# Altium schematic sheet LED_USB_KEY.SchDoc
size 558 x 431 mm
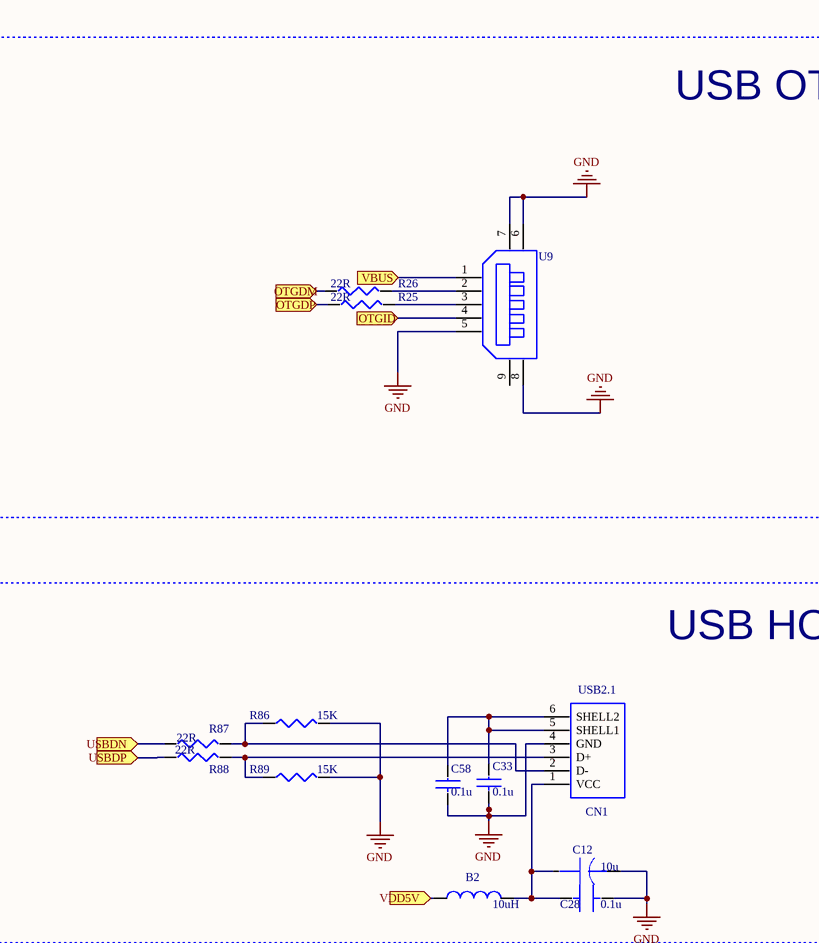
[diagram p0: LED_USB_KEY.SchDoc, top left]
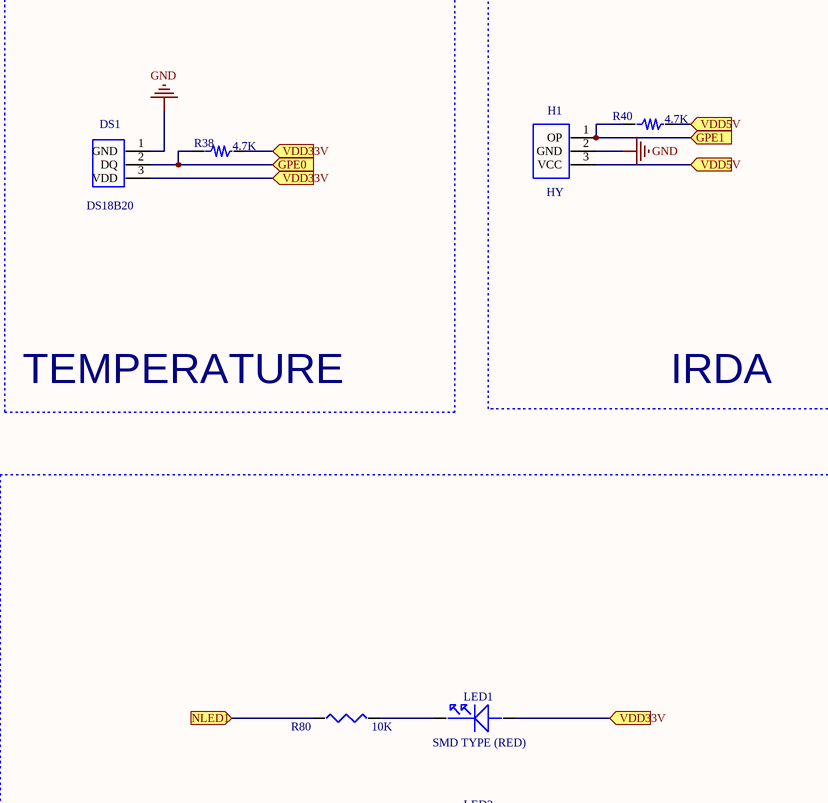
[diagram p1: LED_USB_KEY.SchDoc, top right]
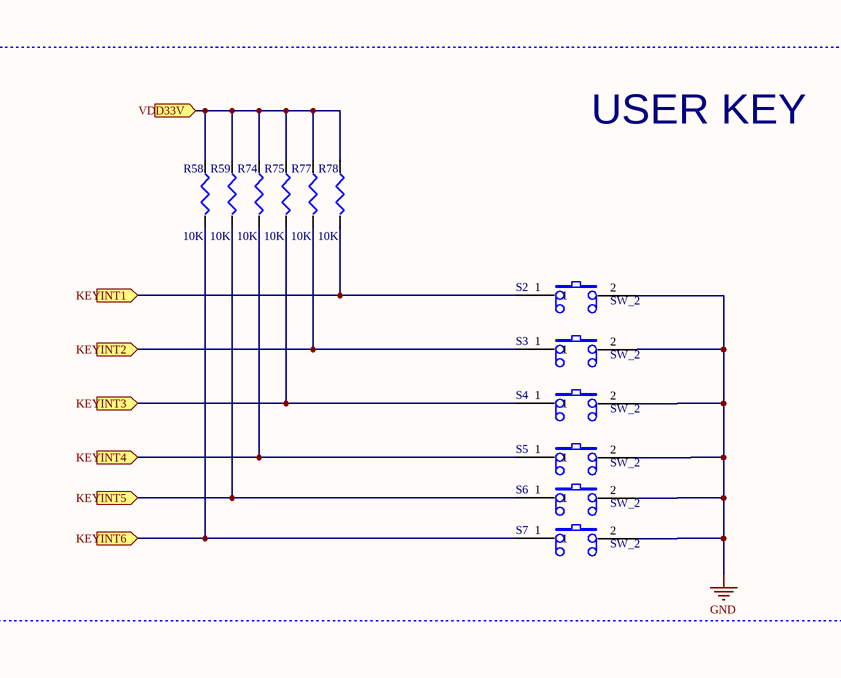
[diagram p2: LED_USB_KEY.SchDoc, bottom left]
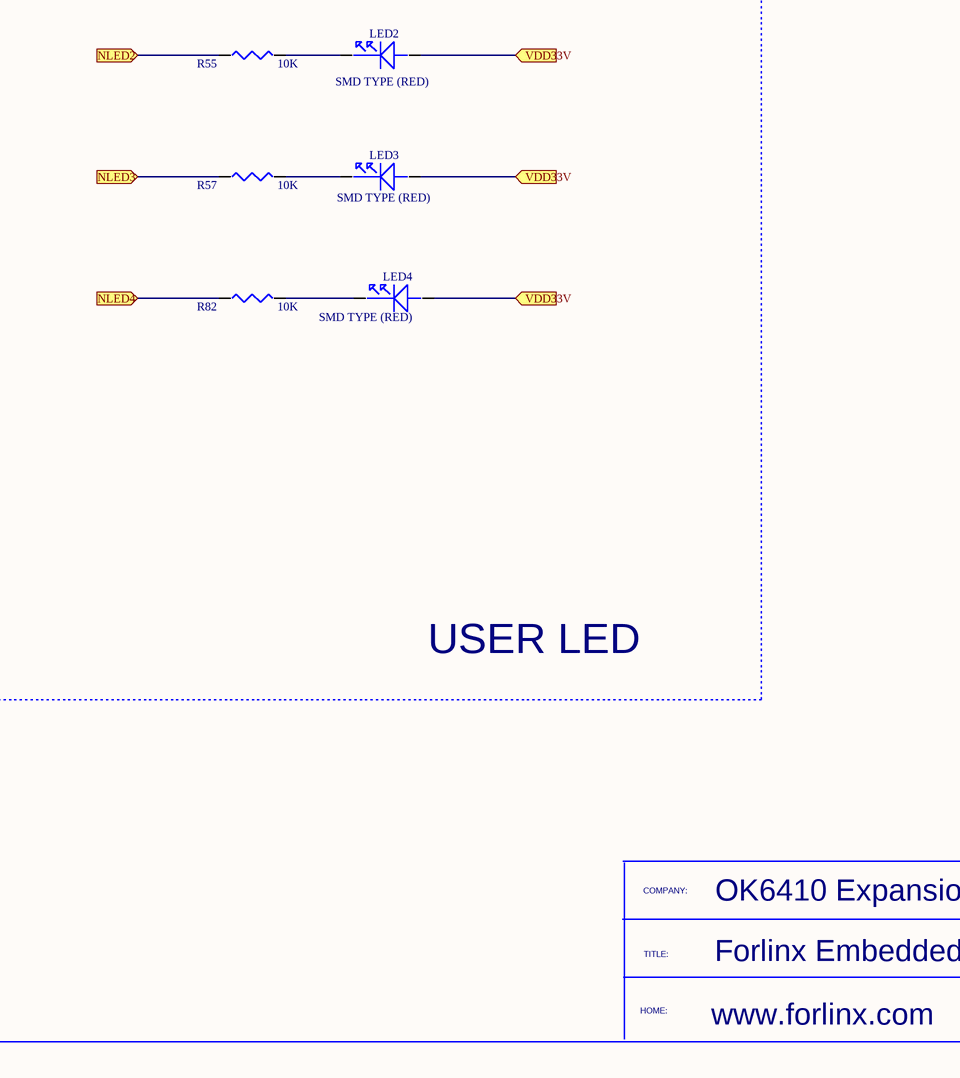
[diagram p3: LED_USB_KEY.SchDoc, bottom right]

## Parts
B2  value 10uH  (hidden comment: INDUCTOR_0)
C12  value 10u  (hidden comment: CAP-AE4)
C28  value 0.1u  (hidden comment: CAP_0)
C33  value 0.1u  (hidden comment: CAP_NP_0)
C58  value 0.1u  (hidden comment: CAP_NP_0)
CN1  USB2.1
DS1  DS18B20
H1  HY
LED1  value SMD TYPE (RED)  (hidden comment: LED_0)
LED2  value SMD TYPE (RED)  (hidden comment: LED_0)
LED3  value SMD TYPE (RED)  (hidden comment: LED_0)
LED4  value SMD TYPE (RED)  (hidden comment: LED_0)
R25  value 22R  (hidden comment: RESISTOR_2)
R26  value 22R  (hidden comment: RESISTOR_2)
R38  value 4.7K  (hidden comment: RES-Z)
R40  value 4.7K  (hidden comment: RES-Z)
R55  value 10K  (hidden comment: RESISTOR_2)
R57  value 10K  (hidden comment: RESISTOR_2)
R58  value 10K  (hidden comment: RESISTOR_2)
R59  value 10K  (hidden comment: RESISTOR_2)
R74  value 10K  (hidden comment: RESISTOR_2)
R75  value 10K  (hidden comment: RESISTOR_2)
R77  value 10K  (hidden comment: RESISTOR_2)
R78  value 10K  (hidden comment: RESISTOR_2)
R80  value 10K  (hidden comment: RESISTOR_2)
R82  value 10K  (hidden comment: RESISTOR_2)
R86  value 15K  (hidden comment: RESISTOR_2)
R87  value 22R  (hidden comment: RESISTOR_2)
R88  value 22R  (hidden comment: RESISTOR_2)
R89  value 15K  (hidden comment: RESISTOR_2)
S2  SW_2
S3  SW_2
S4  SW_2
S5  SW_2
S6  SW_2
S7  SW_2
U9  56579-0576  (value not drawn)

## Blocks framed on the sheet
USB OTG: R25 R26 U9
TEMPERATURE: DS1 R38
IRDA: H1 R40
USER LED: LED1-LED4 R55 R57 R80 R82
USB HOST: B2 C12 C28 C33 C58 CN1 R86-R89
USER KEY: R58 R59 R74 R75 R77 R78 S2-S7

## Ports
GPE0, GPE1, KEYINT1, KEYINT2, KEYINT3, KEYINT4, KEYINT5, KEYINT6, NLED1, NLED2, NLED3, NLED4, OTGDM, OTGDP, OTGID, USBDN, USBDP, VBUS, VDD5V, VDD33V

## Nets
GND: C12.2 C28.2 C33.2 C58.2 CN1.4(GND) DS1.1(GND) H1.2(GND) R86.2 R89.2 S2.2 S3.2 S4.2 S5.2 S6.2 S7.2 U9.5 U9.6 U9.7 U9.8
GPE0: DS1.2(DQ) R38.1 ; port GPE0
GPE1: H1.1(OP) R40.1 ; port GPE1
KEYINT1: R78.2 S2.1 ; port KEYINT1
KEYINT2: R77.2 S3.1 ; port KEYINT2
KEYINT3: R75.2 S4.1 ; port KEYINT3
KEYINT4: R74.2 S5.1 ; port KEYINT4
KEYINT5: R59.2 S6.1 ; port KEYINT5
KEYINT6: R58.2 S7.1 ; port KEYINT6
NLED1: R80.1 ; port NLED1
NLED2: R55.1 ; port NLED2
NLED3: R57.1 ; port NLED3
NLED4: R82.1 ; port NLED4
OTGDM: R26.1 ; port OTGDM
OTGDP: R25.1 ; port OTGDP
OTGID: U9.4 ; port OTGID
USBDN: R87.1 ; port USBDN
USBDP: R88.1 ; port USBDP
VBUS: U9.1 ; port VBUS
VDD5V: B2.1 H1.3(VCC) R40.2 ; port VDD5V
VDD33V: DS1.3(VDD) LED1.1 LED2.1 LED3.1 LED4.1 R38.2 R58.1 R59.1 R74.1 R75.1 R77.1 R78.1 ; port VDD33V
NetB2_2: B2.2 C12.1 C28.1 CN1.1(VCC)
NetC33_1: C33.1 C58.1 CN1.2(D-) CN1.5(SHELL1) CN1.6(SHELL2) R86.1 R87.2
NetCN1_3: CN1.3(D+) R88.2 R89.1
NetLED1_2: LED1.2 R80.2
NetLED2_2: LED2.2 R55.2
NetLED3_2: LED3.2 R57.2
NetLED4_2: LED4.2 R82.2
NetR25_2: R25.2 U9.3
NetR26_2: R26.2 U9.2

Not connected (* = marked no-connect by the designer): U9 9

## Notes on the sheet
- COMPANY:
- TITLE:
- OK6410 Expansion Board
- HOME:
- www.forlinx.com
- Forlinx Embedded

## Library data of the parts
B2 = INDUCTOR_0: PCB DECAL: 1206
C12 = CAP-AE4: ALUMINUM ELECTROLYTIC CAP.; Manufacturer #1: IPC SM-782 STD.; PCB DECAL: 3216A
C28 = CAP_0: PCB Footprint: C0805; Source Path: C:\ORCADWIN\CAPTURE\DESIGN\MCU\S3C2400X\EV-BOARD\SMDK2400-72F.DSN; PCB DECAL: 0603A
C33 C58 = CAP_NP_0: PCB Footprint: C2012; PCB DECAL: 0603A
CN1 = USB2.1: PCB DECAL: USB-B2
DS1 = DS18B20: PCB DECAL: DSAAAA
H1 = HY: PCB DECAL: HY01
LED1-LED3 = LED_0: PCB Footprint: CAP3528; PCB DECAL: LEDX
LED4 = LED_0: PCB Footprint: CAP3528; PCB DECAL: LED1206N
R25 R26 R86-R89 = RESISTOR_2: PCB Footprint: C2012; PCB DECAL: 0603A
R38 R40 = RES-Z: RES BODY:060 CENTERS:400; PCB DECAL: 0603A
R55 R57-R59 R74 R75 R77 R78 R80 R82 = RESISTOR_2: PCB Footprint: C2012; Source Path: C:\WINDOW\GENERAL\2400\SCHEM\2400\SMDK2400-72F.DSN; PCB DECAL: 0603A
S2-S7 = SW_2: PCB Footprint: TM118D-A; Value: SW_PUSH2; PCB DECAL: SW-PB2
U9 = 56579-0576: PCB DECAL: USB\S